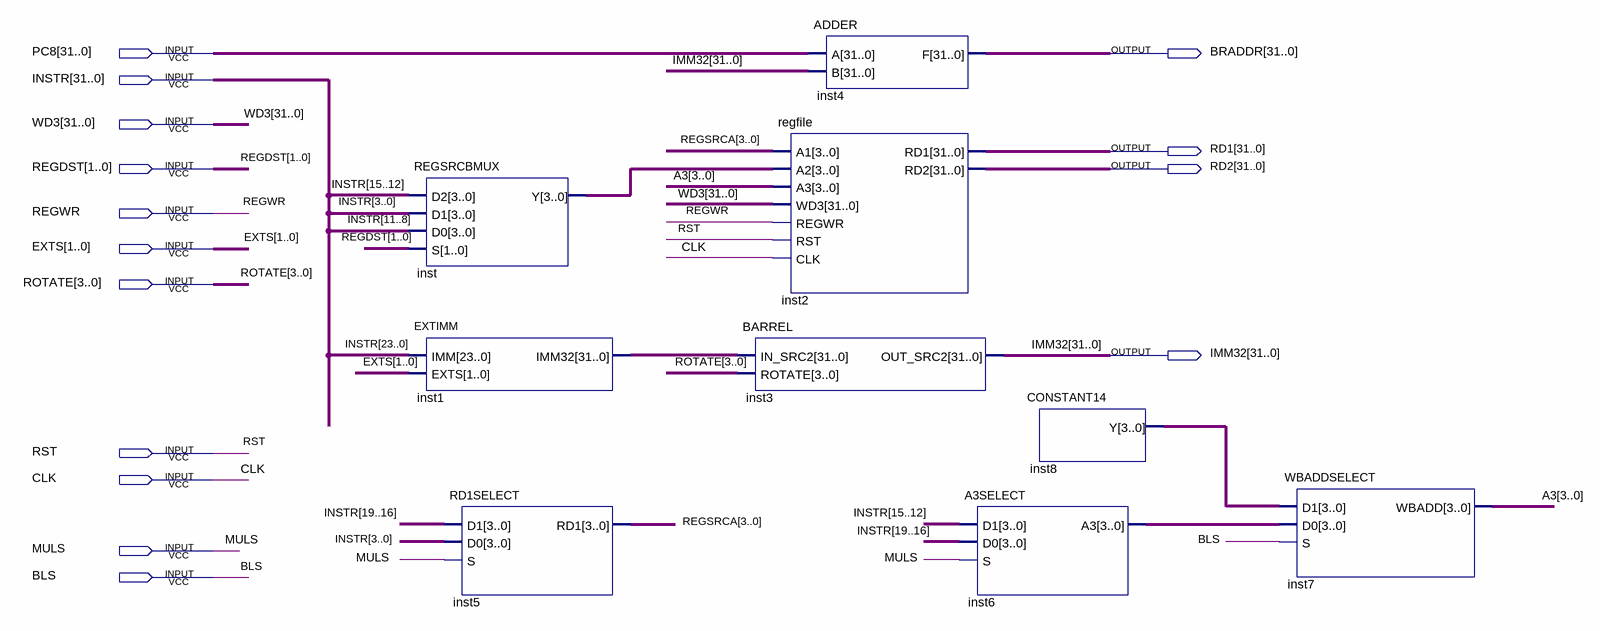
[diagram p0: schematic sheet]
// Quartus schematic decode.bdf as structural Verilog: 9 symbols, 15 pins
module decode (
  input  [31:0] PC8,
  input  [31:0] INSTR,
  input  [31:0] WD3,
  input  [1:0] REGDST,
  input  REGWR,
  input  [1:0] EXTS,
  input  [3:0] ROTATE,
  input  RST,
  input  CLK,
  input  MULS,
  input  BLS,
  output [31:0] BRADDR,
  output [31:0] RD1,
  output [31:0] RD2,
  output [31:0] IMM32
);

  wire [3:0] A3, inst6_a3, inst8_y, inst_y, REGSRCA;
  wire [31:0] inst1_imm32;

  REGSRCBMUX inst (.D2(INSTR[15:12]), .D1(INSTR[3:0]), .D0(INSTR[11:8]), .S(REGDST), .Y(inst_y));
  EXTIMM inst1 (.IMM(INSTR[23:0]), .EXTS(EXTS), .IMM32(inst1_imm32));
  RD1SELECT inst5 (.D1(INSTR[19:16]), .D0(INSTR[3:0]), .S(MULS), .RD1(REGSRCA));
  regfile inst2 (
    .A1(REGSRCA), .A2(inst_y), .A3(A3), .WD3(WD3), .REGWR(REGWR), .RST(RST), .CLK(CLK), .RD1(RD1), .RD2(RD2));
  BARREL inst3 (.IN_SRC2(inst1_imm32), .ROTATE(ROTATE), .OUT_SRC2(IMM32));
  ADDER inst4 (.A(PC8), .B(IMM32), .F(BRADDR));
  A3SELECT inst6 (.D1(INSTR[15:12]), .D0(INSTR[19:16]), .S(MULS), .A3(inst6_a3));
  CONSTANT14 inst8 (.Y(inst8_y));
  WBADDSELECT inst7 (.D1(inst8_y), .D0(inst6_a3), .S(BLS), .WBADD(A3));
endmodule
